# EAGLE design Shruti-Main-v06 untested (EAGLE 5.09)
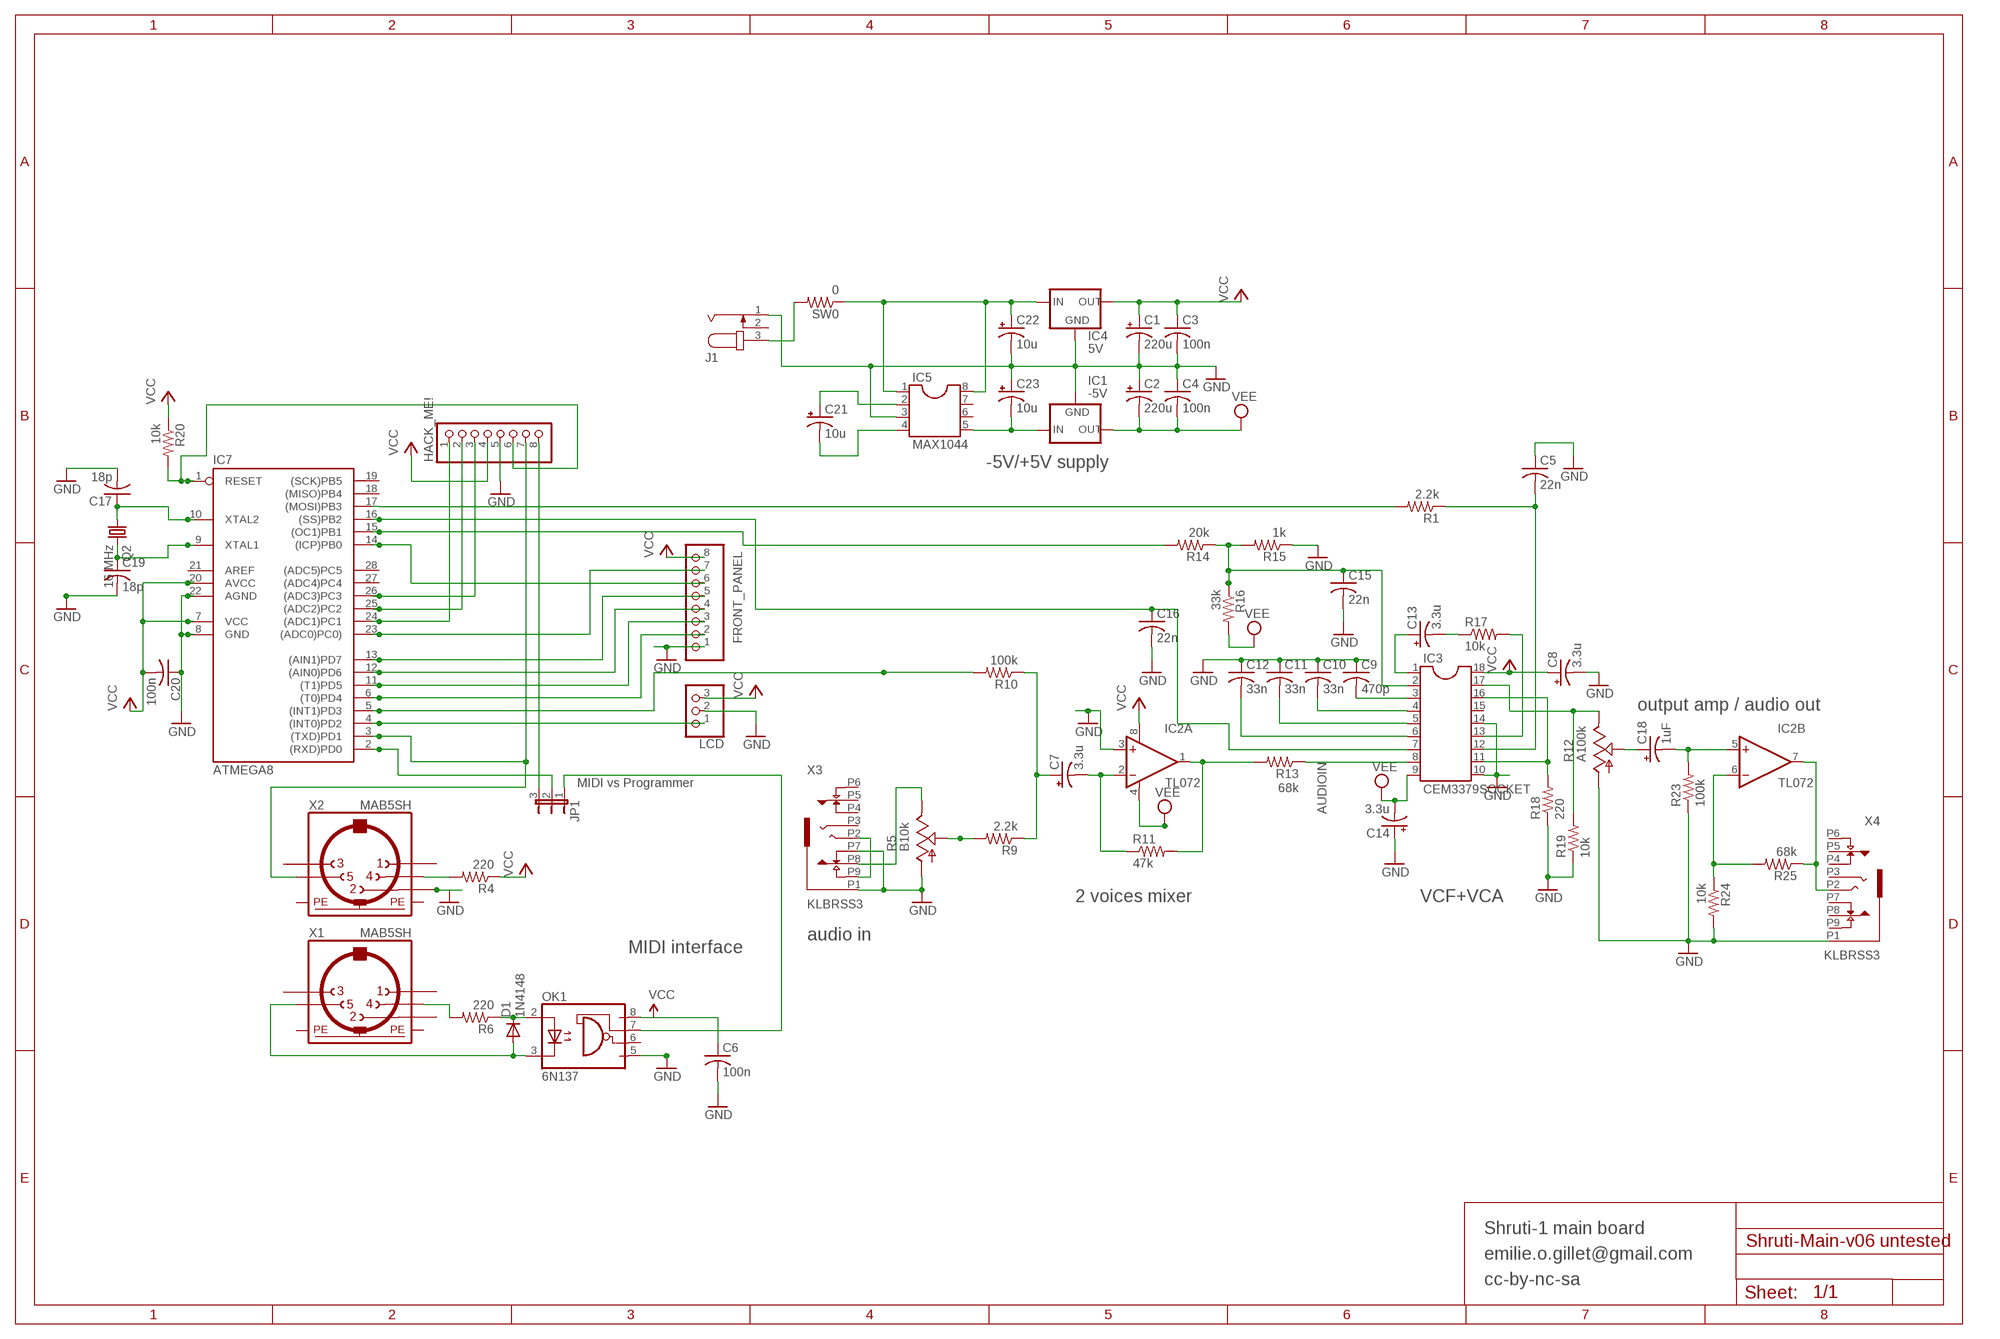
[diagram p0: schematic, sheet 1]

## Parts
C1  220u  CPOL-USE5-8.5  [E5-8,5]
C2  220u  CPOL-USE5-8.5  [E5-8,5]
C3  100n  C-US050-024X044  [C050-024X044]
C4  100n  C-US050-024X044  [C050-024X044]
C5  22n  C-US050-025X075  [C050-025X075]
C6  100n  C-US050-024X044  [C050-024X044]
C7  3.3u  CPOL-USE2.5-6  [E2,5-6]
C8  3.3u  CPOL-USE2.5-6  [E2,5-6]
C9  470p  C-US050-024X044  [C050-024X044]
C10  33n  C-US050-025X075  [C050-025X075]
C11  33n  C-US050-025X075  [C050-025X075]
C12  33n  C-US050-025X075  [C050-025X075]
C13  3.3u  CPOL-USE2.5-6  [E2,5-6]
C14  3.3u  CPOL-USE2.5-6  [E2,5-6]
C15  22n  C-US050-025X075  [C050-025X075]
C16  22n  C-US050-025X075  [C050-025X075]
C17  18p  C-US050-024X044  [C050-024X044]
C18  1uF  CPOL-USE2.5-5  [E2,5-5]
C19  18p  C-US050-024X044  [C050-024X044]
C20  100n  C-US050-024X044  [C050-024X044]
C21  10u  CPOL-USE2.5-6  [E2,5-6]
C22  10u  CPOL-USE2.5-6  [E2,5-6]
C23  10u  CPOL-USE2.5-6  [E2,5-6]
D1  1N4148  1N4148DO35-7  [DO35-7]
FRONT_PANEL  PINHD-1X8  [1X08]
HACK_ME!  PINHD-1X8  [1X08]
IC1  -5V  79XXL  [79XXL]
IC2  TL072  OPA2132P  [DIL08]
IC3  CEM3379SOCKET  [SOCKET18]
IC4  5V  78XXL  [78XXL]
IC5  MAX1044  DIL8  [DIL08]
IC7  ATMEGA8  AT90S4433P  [DIL28-3]
J1  JACK-PLUG  [SPC4078_LARGER_HOLES]
JP1  JP2E  [JP2]
LCD  PINHD-1X3  [1X03]
OK1  6N137  [DIL08]
Q2  16 MHz  CRYSTALHC49U-V  [HC49U-V]
R1  2.2k  R-US_0204/7  [0204/7]
R4  220  R-US_0204/7  [0204/7]
R5  B10k  POT_USCABLED  [CABLE_POT_6MM]
R6  220  R-US_0204/7  [0204/7]
R9  2.2k  R-US_0204/7  [0204/7]
R10  100k  R-US_0204/7  [0204/7]
R11  47k  R-US_0204/7  [0204/7]
R12  A100k  POT_USCABLED  [CABLE_POT_6MM]
R13  68k  R-US_0204/7  [0204/7]
R14  20k  R-US_0204/7  [0204/7]
R15  1k  R-US_0204/7  [0204/7]
R16  33k  R-US_0204/7  [0204/7]
R17  10k  R-US_0204/7  [0204/7]
R18  220  R-US_0204/7  [0204/7]
R19  10k  R-US_0204/7  [0204/7]
R20  10k  R-US_0204/7  [0204/7]
R23  100k  R-US_0204/7  [0204/7]
R24  10k  R-US_0204/7  [0204/7]
R25  68k  R-US_0204/7  [0204/7]
SW0  0  R-US_0204/2V  [0204V]
X1  MAB5SH  [MAB5SH]
X2  MAB5SH  [MAB5SH]
X3  KLBRSS3  [KLBRSS3]
X4  KLBRSS3  [KLBRSS3]

## Nets
AUDIOIN: IC2.1(A:OUT) R11.2 R13.2
GND: C1.- C2.+ C3.2 C4.1 C5.1 C6.2 C8.- C9.1 C10.1 C11.1 C12.1 C14.+ C15.2 C16.2 C17.2 C19.2 C20.1 C22.- C23.+ FRONT_PANEL.1 HACK_ME!.5 IC1.GND IC2.3(A:+IN) IC3.10(GND) IC3.14(PANCV) IC4.GND IC5.3 IC7.8(GND) IC7.22(AGND) J1.1 LCD.2 OK1.5(GND) R5.A R12.A R15.1 R18.1 R19.1 R23.1 R24.2 X2.2 X3.P1 X3.P7 X4.P1
N$1: HACK_ME!.8 JP1.3
N$2: C22.+ IC4.IN IC5.1 IC5.8 SW0.1
N$3: C21.+ IC5.2
N$4: FRONT_PANEL.2 IC7.6((T0)PD4)
N$5: IC3.8(VCFIN) R13.1
N$6: R4.2 X2.4
N$7: HACK_ME!.2 IC7.25((ADC2)PC2)
N$8: FRONT_PANEL.7 IC7.23((ADC0)PC0))
N$9: FRONT_PANEL.4 IC7.12((AIN0)PD6)
N$10: FRONT_PANEL.5 IC7.13((AIN1)PD7)
N$11: IC7.4((INT0)PD2) LCD.1
N$12: IC7.5((INT1)PD3) R10.2
N$13: HACK_ME!.7 IC7.3((TXD)PD1) X2.5
N$14: D1.C OK1.2(A) R6.1
N$15: C17.1 IC7.10(XTAL2) Q2.1
N$16: D1.A OK1.3(C) X1.5
N$17: R6.2 X1.4
N$18: JP1.1 OK1.7(VE)
N$19: IC7.17((MOSI)PB3) R1.2
N$21: C7.- IC2.2(A:-IN) R11.1
N$22: FRONT_PANEL.3 IC7.11((T1)PD5)
N$23: C7.+ R9.1 R10.1
N$24: R5.S R9.2
N$25: C18.- IC2.5(B:+IN) R23.2
N$26: C9.2 IC3.3(CD)
N$27: C10.2 IC3.4(CC)
N$29: C11.2 IC3.5(CB)
N$30: IC3.17(CHB) R12.E R19.2
N$31: C12.2 IC3.6(CA)
N$32: IC7.15((OC1)PB1) R14.2
N$33: C16.1 IC3.7(RESONANCECV) IC7.16((SS)PB2)
N$34: C5.2 IC3.12(GAINCV) R1.1
N$35: IC3.13(VCAIN) R17.2
N$36: C13.- R17.1
N$37: IC2.7(B:OUT) R25.1 X4.P2
N$38: IC3.11(VCAOUT) IC3.16(PANIN) R18.2
N$39: C13.+ IC3.1(VCFOUT)
N$41: R5.E X3.P8
N$42: HACK_ME!.6 IC7.1(RESET) R20.2
N$43: C15.1 IC3.2(FREQUENCYCV) R14.1 R15.2 R16.1
N$44: C18.+ R12.S
N$45: IC2.6(B:-IN) R24.1 R25.2
N$47: J1.3 SW0.2
N$48: C19.1 IC7.9(XTAL1) Q2.2
N$49: HACK_ME!.3 IC7.26((ADC3)PC3)
N$50: FRONT_PANEL.6 IC7.14((ICP)PB0)
N$52: HACK_ME!.1 IC7.24((ADC1)PC1)
N$53: IC7.2((RXD)PD0) JP1.2
N$55: C21.- IC5.4
N$56: C23.- IC1.IN IC5.5
N$57: X3.P2 X3.P9
VCC: C1.+ C3.1 C6.1 C8.+ C20.2 FRONT_PANEL.8 HACK_ME!.4 IC2.8(A:V+) IC3.18(VCC) IC4.OUT IC7.7(VCC) IC7.20(AVCC) LCD.3 OK1.8(VCC) R4.1 R20.1
VEE: C2.- C4.2 C14.- IC1.OUT IC2.4(A:V-) IC3.9(VEE) R16.2
Unconnected: IC3.15(CHAOUT) IC5.6 IC5.7 IC7.18((MISO)PB4) IC7.19((SCK)PB5) IC7.21(AREF) IC7.27((ADC4)PC4) IC7.28((ADC5)PC5) J1.2 OK1.6(VO) X1.1 X1.2 X1.3 X2.1 X2.3 X3.P3 X3.P4 X3.P5 X3.P6 X4.P3 X4.P4 X4.P5 X4.P6 X4.P7 X4.P8 X4.P9

## Notes on the sheet
- -5V/+5V supply
- output amp / audio out
- MIDI vs Programmer
- 2 voices mixer | VCF+VCA
- audio in
- MIDI interface
- Shruti-1 main board
- emilie.o.gillet@gmail.com
- cc-by-nc-sa

## Power pins joined to a net without a drawn wire
PE: X1.PE X1.PE@(PE) X2.PE X2.PE@(PE)

## Library data of the parts
C1 C2 C7 C8 C13 C14 C18 C21-C23 = rcl:CPOL-US: POLARIZED CAPACITOR, American symbol
C3-C6 C9-C12 C15-C17 C19 C20 = rcl:C-US: CAPACITOR, American symbol
D1 = diode:1N4148: DIODE high speed (Philips)
FRONT_PANEL HACK_ME! = pinhead:PINHD-1X8: PIN HEADER
IC1 = v-reg:79XXL: VOLTAGE REGULATOR
IC2 = burr-brown:OPA2132: High Speed FET-Input Operational Amplifiers< Product Folder:OPA2132
IC3 = cem:CEM3379: Voltage Controlled Signal Processor VCF+VCA+panner
IC4 = v-reg:78XXL: VOLTAGE REGULATOR
IC5 = ic-package:DIL8: Dual In Line / Socket
IC7 = atmel:AT90S4433: MICROCONTROLLER 4 Kbytes FLASH 128 bytes SRAM 256 bytes EEPROM UART 6-channel 10 bit ADC
J1 = con-jack:JACK-PLUG: DC POWER JACK Power Jack, DC, Right Angle, Through Hole, Rated 5A at 16VDC, PC Terminals Distributor: Farnell (www.Farnell.de) Drawing: 84N1161.pdf / 84N1162.pdf Manufacturer: SPC Technology (www.spctechnology.com) Type: SPC4077 / SPC 4078
JP1 = jumper:JP2E: JUMPER
LCD = pinhead:PINHD-1X3: PIN HEADER
OK1 = optocoupler:6N137: MOTOROLA OPTO COUPLER
Q2 = crystal:CRYSTAL: CRYSTAL
R1 R4 R6 R9-R11 R13-R20 R23-R25 SW0 = resistor:R-US_: RESISTOR, American symbol
R5 R12 = pot-cable:POT_US
X1 X2 = con-hirschmann:MAB5SH: Female CONNECTOR 5 pins 90 deg. with shield, horizontal (DIN 41524)
X3 X4 = klbrss3:KLBRSS3: 6.35" Jack connector

## Board
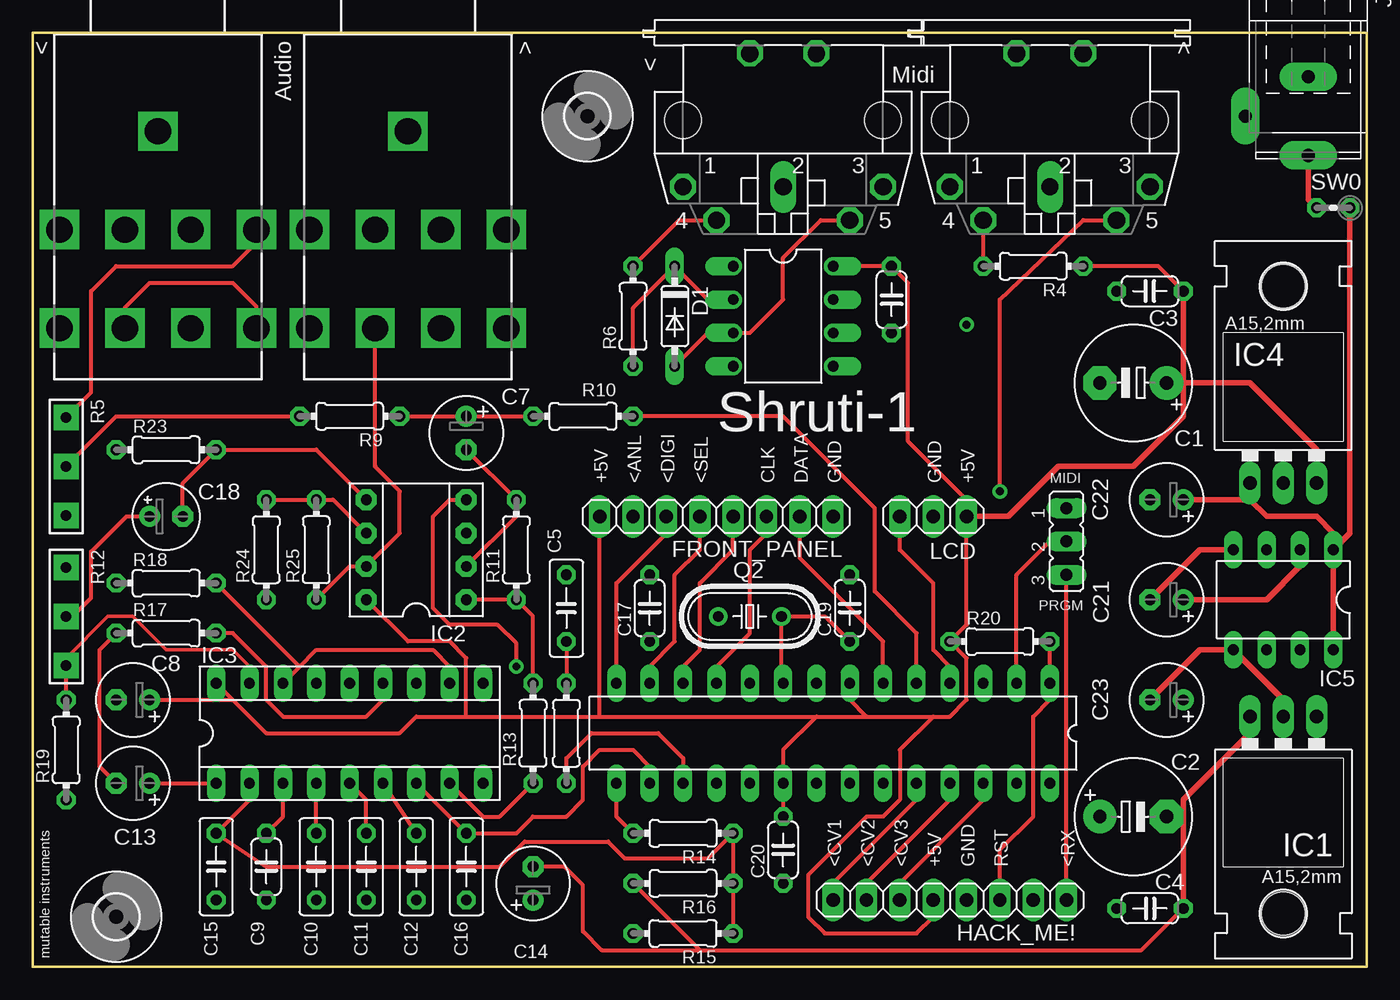
[diagram p1: board, top side]
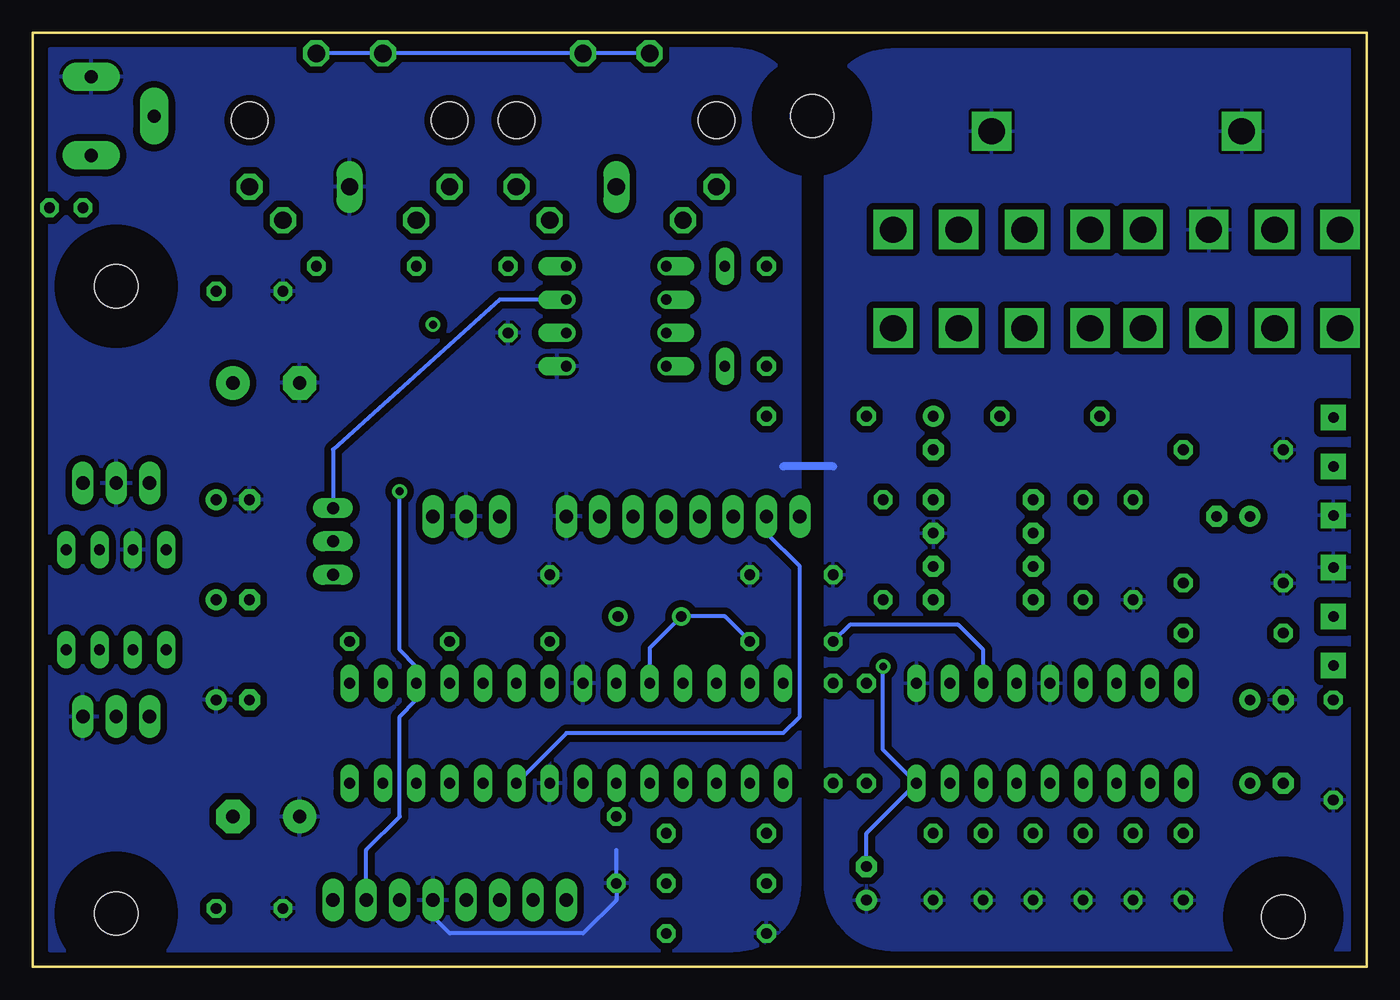
[diagram p2: board, bottom side, seen from below]

Size 101.6 x 71.11 mm. Coordinates in mm from the lower left corner, seen from the top.
Outline: 101.6,0 101.6,71.11 0,71.11 0,0 101.6,0
Copper layers (1*16): Top 0.035mm / dielectric 1.5mm / Bottom 0.035mm
Design rules "SparkFun *": minimum track width 8mil, minimum drill 20mil, track to track 8mil, track to pad 12mil, pad to pad 8mil, via to via 8mil, smd to smd 8mil, copper to edge 10mil, drill to drill 8mil, minimum pad ring 12mil, minimum via ring 10mil, stop-mask expansion 4mil, vias tented up to drill 25mil, thermal gap 10mil

### Footprints (pad centres in the part's own frame; a part is rotated, then mirrored left to right if it is on the bottom)
E5-8,5 = drill 1.016 pad 2.54 round: + -2.54,0 | drill 1.016 pad 2.54 octagon: - 2.54,0
C050-024X044 = drill 0.813 octagon: 1 -2.54,0; 2 2.54,0
C050-025X075 = drill 0.813 octagon: 1 -2.54,0; 2 2.54,0
E2,5-6 = drill 0.813 pad 1.6 round: + -1.27,0 | drill 0.813 pad 1.6 octagon: - 1.27,0
E2,5-5 = drill 0.813 pad 1.6 round: + -1.27,0 | drill 0.813 pad 1.6 octagon: - 1.27,0
DO35-7 = drill 0.813 long: A 3.81,0; C -3.81,0
1X08 = drill 1.016 long: 1 -8.89,0; 2 -6.35,0; 3 -3.81,0; 4 -1.27,0; 5 1.27,0; 6 3.81,0; 7 6.35,0; 8 8.89,0
79XXL = drill 1.016 long: GND -2.54,-3.81; IN 0,-3.81; OUT 2.54,-3.81 | hole 3.302: 0,11.176
DIL08 = drill 0.813 pad 1.6 octagon: 1 -3.81,-3.81; 2 -1.27,-3.81; 3 1.27,-3.81; 4 3.81,-3.81; 5 3.81,3.81; 6 1.27,3.81; 7 -1.27,3.81; 8 -3.81,3.81
SOCKET18 = drill 0.813 long: 1 -10.16,-3.81; 2 -7.62,-3.81; 3 -5.08,-3.81; 4 -2.54,-3.81; 5 0,-3.81; 6 2.54,-3.81; 7 5.08,-3.81; 8 7.62,-3.81; 9 10.16,-3.81; 10 10.16,3.81; 11 7.62,3.81; 12 5.08,3.81; 13 2.54,3.81; 14 0,3.81; 15 -2.54,3.81; 16 -5.08,3.81; 17 -7.62,3.81; 18 -10.16,3.81
78XXL = drill 1.016 long: GND 0,-3.81; IN -2.54,-3.81; OUT 2.54,-3.81 | hole 3.302: 0,11.176
DIL08' = drill 0.813 long: 1 -3.81,-3.81; 2 -1.27,-3.81; 3 1.27,-3.81; 4 3.81,-3.81; 5 3.81,3.81; 6 1.27,3.81; 7 -1.27,3.81; 8 -3.81,3.81
DIL28-3 = drill 0.813 long: 1 -16.51,-3.81; 2 -13.97,-3.81; 3 -11.43,-3.81; 4 -8.89,-3.81; 5 -6.35,-3.81; 6 -3.81,-3.81; 7 -1.27,-3.81; 8 1.27,-3.81; 9 3.81,-3.81; 10 6.35,-3.81; 11 8.89,-3.81; 12 11.43,-3.81; 13 13.97,-3.81; 14 16.51,-3.81; 15 16.51,3.81; 16 13.97,3.81; 17 11.43,3.81; 18 8.89,3.81; 19 6.35,3.81; 20 3.81,3.81; 21 1.27,3.81; 22 -1.27,3.81; 23 -3.81,3.81; 24 -6.35,3.81; 25 -8.89,3.81; 26 -11.43,3.81; 27 -13.97,3.81; 28 -16.51,3.81
SPC4078_LARGER_HOLES = drill 1 pad 2.184 long: 1 -3,0; 2 0,-4.8; 3 3,0
JP2 = drill 0.914 long: 1 -2.54,0; 2 0,0; 3 2.54,0
1X03 = drill 1.016 long: 1 -2.54,0; 2 0,0; 3 2.54,0
DIL08'' = drill 0.813 offset: 1 -3.81,-3.81; 2 -1.27,-3.81; 3 1.27,-3.81; 4 3.81,-3.81; 5 3.81,3.81; 6 1.27,3.81; 7 -1.27,3.81; 8 -3.81,3.81
HC49U-V = drill 0.813 round: 1 -2.413,0; 2 2.413,0
0204/7 = drill 0.813 octagon: 1 -3.81,0; 2 3.81,0
CABLE_POT_6MM = drill 0.8 pad 1.93 square: A -3.73,0; E 3.73,0; S 0,0
0204V = drill 0.813 octagon: 1 -1.27,0; 2 1.27,0
3,3 = hole 3.3: 0,0
MAB5SH = drill 1.321 octagon: 1 7.62,5.08; 3 -7.62,5.08; 4 5.08,7.62; 5 -5.08,7.62; PE -2.54,-5.08; PE@ 2.54,-5.08 | drill 1.321 long: 2 0,5.08 | hole 2.794: 7.62,0; -7.62,0
KLBRSS3 = drill 2 pad 2.54 square: P1 0,-7.5; P2 -2.5,-22.5; P3 2.5,-22.5; P4 -2.5,-15; P5 -7.5,-15; P6 -7.5,-22.5; P7 2.5,-15; P8 7.5,-15; P9 7.5,-22.5

### Placement (x,y rotation side)
C1  83.82,44.45 180 top
C2  83.82,11.43 0 top
C3  85.09,51.44 180 top
C4  85.09,4.45 0 top
C5  40.64,27.3 270 top
C6  65.41,50.8 270 top
C7  33.02,40.64 270 top
C8  7.62,20.32 180 top
C9  17.78,7.62 90 top
C10  21.59,7.62 90 top
C11  25.4,7.62 90 top
C12  29.21,7.62 90 top
C13  7.62,13.97 180 top
C14  38.1,6.35 90 top
C15  13.97,7.62 270 top
C16  33.02,7.62 270 top
C17  46.99,27.3 90 top
C18  10.16,34.29 0 top
C19  62.23,27.3 90 top
C20  57.15,8.89 90 top
C21  86.36,27.94 180 top
C22  86.36,35.56 180 top
C23  86.36,20.32 180 top
D1  48.9,49.53 270 top
FRONT_PANEL  52.07,34.29 180 top
HACK_ME!  69.85,5.08 0 top
IC1  95.25,15.24 180 top
IC2  29.21,31.75 90 top
IC3  24.13,17.78 0 top
IC4  95.25,40.64 0 top
IC5  MAX1044  [DIL08']  95.25,27.94 180 top
IC7  60.96,17.78 180 top
J1  97.16,64.77 270 top
JP1  78.74,32.38 270 top
LCD  68.58,34.29 0 top
OK1  6N137  [DIL08'']  57.15,49.53 270 top
Q2  54.61,26.67 0 top
R1  40.64,17.78 270 top
R4  76.2,53.34 180 top
R5  2.54,38.1 90 top
R6  45.72,49.53 90 top
R9  24.13,41.91 180 top
R10  41.91,41.91 0 top
R11  36.83,31.75 270 top
R12  2.54,26.67 270 top
R13  38.1,17.78 90 top
R14  49.53,10.16 180 top
R15  49.53,2.54 0 top
R16  49.53,6.35 180 top
R17  10.16,25.4 0 top
R18  10.16,29.21 0 top
R19  2.54,16.51 90 top
R20  73.66,24.77 0 top
R23  10.16,39.37 0 top
R24  17.78,31.75 270 top
R25  21.59,31.75 90 top
SW0  99.06,57.78 180 top
U$3  [3,3]  6.35,3.81 0 top
U$4  [3,3]  42.24,64.77 0 top
X1  57.15,64.47 180 top
X2  77.47,64.47 180 top
X3  9.53,71.12 0 top
X4  28.57,71.12 0 top

### Tracks (layer width: path | path; a pad name or v marks a point on that pad's centre or on a via)
AUDIOIN
  Top 0.305: IC2.1 R11.2 38.1,26.67 R13.2
GND
  Bottom 0.305: HACK_ME!.5 71.12,3.81 69.85,2.54 59.69,2.54 57.15,5.08 C20.1 57.15,8.89 | LCD.2 68.58,35.56
  Bottom 0.61: 40.64,38.1 44.45,38.1
  pour Bottom (isolate 0.508): 1.27,69.85 1.27,1.27 36.2,1.27 arc90 41.27,6.35 41.27,64.77 arc90 36.2,69.85
  pour Bottom (isolate 0.508): 48.26,69.85 100.33,69.85 100.33,1.27 48.26,1.27 arc-90 43.18,6.35 43.18,64.77 arc-90
N$1
  Top 0.305: HACK_ME!.8 JP1.3
N$2
  Top 0.406: IC5.1 IC5.8 | 92.71,35.56 93.98,34.29 97.79,34.29 99.06,33.02 IC5.1 | C22.+ 92.71,35.56 | SW0.1 100.33,33.02 IC5.1 | 92.71,35.56 IC4.IN
N$3
  Top 0.406: C21.+ 93.98,27.94 96.52,30.48 IC5.2
N$4
  Top 0.305: IC7.6 64.77,24.77 58.42,31.11 FRONT_PANEL.2
N$5
  Top 0.305: IC3.8 34.29,11.43 35.56,11.43 R13.1
N$6
  Top 0.305: R4.2 X2.4
N$7
  Top 0.305: IC7.25 69.85,12.7 63.5,6.35 HACK_ME!.2
N$8
  Bottom 0.305: FRONT_PANEL.7 45.72,33.02 43.18,30.48 43.18,19.05 44.45,17.78 60.96,17.78 IC7.23
N$9
  Top 0.305: IC7.12 49.53,22.86 50.8,24.13 50.8,29.21 53.34,31.75 FRONT_PANEL.4
N$10
  Top 0.305: IC7.13 46.99,22.86 48.9,24.77 48.9,29.84 50.8,31.75 FRONT_PANEL.5
N$11
  Top 0.305: IC7.4 69.85,22.86 68.58,24.13 68.58,29.21 66.04,31.75 LCD.1
N$12
  Top 0.305: IC7.5 67.31,25.4 64.14,28.57 64.14,34.92 57.15,41.91 R10.2
N$13  (via drill 0.6)
  Top 0.305: X2.5 80.01,56.84 73.66,50.8 v73.66,36.2
  Bottom 0.305: v73.66,36.2 73.66,24.13 72.39,22.86 IC7.3 72.39,20.32 73.66,19.05 73.66,11.43 76.2,8.89 HACK_ME!.7
N$14
  Top 0.305: R6.1 45.72,50.16 D1.C 51.44,50.8 OK1.2
N$15
  Bottom 0.305: IC7.10 54.61,24.26 Q2.1 48.9,26.67 C17.1
N$16
  Top 0.305: D1.A 51.44,48.26 OK1.3 54.61,48.26 57.15,50.8 57.15,53.98 60.02,56.84 X1.5
N$17
  Top 0.305: X1.4 49.23,56.84 R6.2
N$18
  Bottom 0.305: JP1.1 78.74,39.37 66.04,50.8 OK1.7
N$19
  Top 0.305: IC7.17 49.53,15.88 47.62,17.78 42.55,17.78 40.64,15.88 R1.2
N$21
  Top 0.305: IC2.2 36.83,34.29 R11.1 C7.-
N$22
  Top 0.305: IC7.11 52.07,22.86 54.61,25.4 54.61,31.75 55.88,33.02 FRONT_PANEL.3
N$23
  Top 0.305: R10.1 C7.+ R9.1
N$24
  Top 0.305: R9.2 6.35,41.91 R5.S
N$25
  Top 0.305: IC2.5 21.59,39.37 R23.2 11.43,36.83 C18.-
N$26
  Top 0.305: C9.2 19.05,11.43 IC3.3
N$27
  Top 0.305: C10.2 IC3.4
N$28  (via drill 0.6)
  other vias: 71.12,48.9
N$29
  Top 0.305: C11.2 25.4,12.7 IC3.5
N$30
  Top 0.254: IC3.17 16.51,22.86 15.24,24.13 10.16,24.13 7.62,26.67 5.71,26.67 2.54,23.5 R12.E
  Top 0.305: R19.2 R12.E
N$31
  Top 0.305: C12.2 IC3.6
N$32
  Top 0.305: R14.2 44.45,11.43 IC7.15
N$33
  Top 0.305: IC3.7 C16.1 36.83,10.16 38.1,11.43 40.64,11.43 41.91,12.7 41.91,15.24 43.18,16.51 45.72,16.51 46.99,15.24 IC7.16
N$34
  Top 0.305: C5.2 R1.1
  Bottom 0.305: IC3.12 29.21,24.13 31.11,26.04 39.37,26.04 C5.2
N$35
  Top 0.305: IC3.13 26.67,20.32 25.4,19.05 19.05,19.05 17.78,20.32 17.78,22.86 15.24,25.4 R17.2
N$36
  Top 0.305: C13.- 5.08,15.24 5.08,24.13 R17.1
N$37
  Top 0.305: R25.1 24.13,30.48 IC2.7 27.94,33.02 27.94,36.2 26.04,38.1 26.07,38.14 X4.P2
N$38
  Top 0.305: 20.32,22.86 R18.2 | IC3.16 20.32,22.86 | 20.32,22.86 21.59,24.13 30.48,24.13 31.75,22.86 IC3.11
N$39
  Top 0.305: C13.+ IC3.1
N$41
  Top 0.305: X3.P8 17.02,55.12 15.24,53.34 6.35,53.34 4.45,51.44 4.45,43.73 R5.E
N$42
  Top 0.305: R20.2 IC7.1 77.47,20.32 76.2,19.05 76.2,11.43 73.66,8.89 HACK_ME!.6
N$43
  Top 0.305: R15.2 R16.1 R14.1 51.44,8.26 45.09,8.26 43.81,9.53 37.47,9.53 35.56,7.62 17.78,7.62 C15.1 16.51,12.7 IC3.2
N$44
  Top 0.305: R12.S 3.02,26.67 4.45,28.09 4.45,31.6 7.13,34.29 C18.+
N$45
  Top 0.305: R24.1 R25.2 22.86,35.56 IC2.6
N$47
  Top 0.406: SW0.2 97.16,58.42 J1.3
N$48
  Top 0.305: IC7.9 57.02,21.72 Q2.2 60.33,26.67 C19.1
N$49
  Top 0.305: IC7.26 72.39,12.7 66.04,6.35 HACK_ME!.3
N$50
  Top 0.305: IC7.14 44.45,29.21 48.26,33.02 FRONT_PANEL.6
N$52
  Top 0.305: IC7.24 67.31,12.7 60.96,6.35 HACK_ME!.1
N$53
  Top 0.305: IC7.2 74.93,29.84 77.47,32.38 JP1.2
N$55
  Top 0.406: IC5.4 88.9,31.75 C21.-
N$56
  Top 0.406: IC1.IN 95.25,20.32 IC5.5 88.9,24.13 C23.-
N$57
  Top 0.305: X3.P2 7.03,50.2 8.89,52.07 15.24,52.07 17.02,50.28 X3.P9
PE
  Bottom 0.305: X1.PE@ X1.PE X2.PE@ X2.PE
VCC
  Top 0.305: C8.+ 15.24,20.32 | 63.5,19.05 68.58,19.05 | 68.58,19.05 69.85,19.05 71.12,20.32 71.12,23.5 R20.1 71.12,26.04 LCD.3 71.12,35.56 66.67,40.01 66.67,52.07 C6.1 OK1.8 | 63.5,19.05 62.23,20.32 IC7.7 | 59.69,19.05 57.15,16.51 IC7.20 C20.2 | 43.18,19.05 FRONT_PANEL.8 | 43.18,19.05 59.69,19.05 | 59.69,19.05 63.5,19.05 | 33.02,19.05 29.21,19.05 27.94,17.78 17.78,17.78 15.24,20.32 | 33.02,19.05 43.18,19.05 | 15.24,20.32 IC3.18 | R4.1 85.72,53.34 C3.1 | 68.58,19.05 66.04,16.51 66.04,12.7 64.77,11.43 63.5,11.43 59.05,6.99 59.05,3.81 60.33,2.54 67.31,2.54 68.58,3.81 HACK_ME!.4 | IC2.8 28.57,24.77 31.75,24.77 33.02,23.5 33.02,19.05
  Top 0.406: IC4.OUT 97.79,39.37 92.71,44.45 C1.+ 87.63,44.45 | 87.63,44.45 C3.1 | 87.63,44.45 87.63,41.91 83.82,38.1 78.11,38.1 74.3,34.29 LCD.3
VEE  (via drill 0.6)
  Top 0.305: C4.2 84.45,1.27 50.8,1.27 | 50.8,1.27 R16.2 | 50.8,1.27 43.33,1.27 41.91,2.69 41.91,6.2 40.49,7.62 C14.- | v36.83,22.86 36.83,24.61 35.41,26.04 31.75,26.04 30.48,27.3 30.48,34.29 31.75,35.56 IC2.4
  Top 0.406: 87.63,11.43 87.63,12.7 92.71,17.78 IC1.OUT | C4.2 87.63,11.43 | 87.63,11.43 C2.-
  Bottom 0.305: C14.- 38.1,10.16 IC3.9 36.83,16.51 v36.83,22.86

### Text on the board
tPlace: < | Audio | > | > | < | Midi | Shruti-1 | +5V | <ANL | <DIGI | <SEL | CLK | DATA | GND | GND | +5V | MIDI | PRGM | <CV1 | <CV2 | <CV3 | +5V | GND | RST | <RX
tNames: mutable instruments
license: ol.gillet@gmail.com | cc-by-nc-sa 3.0